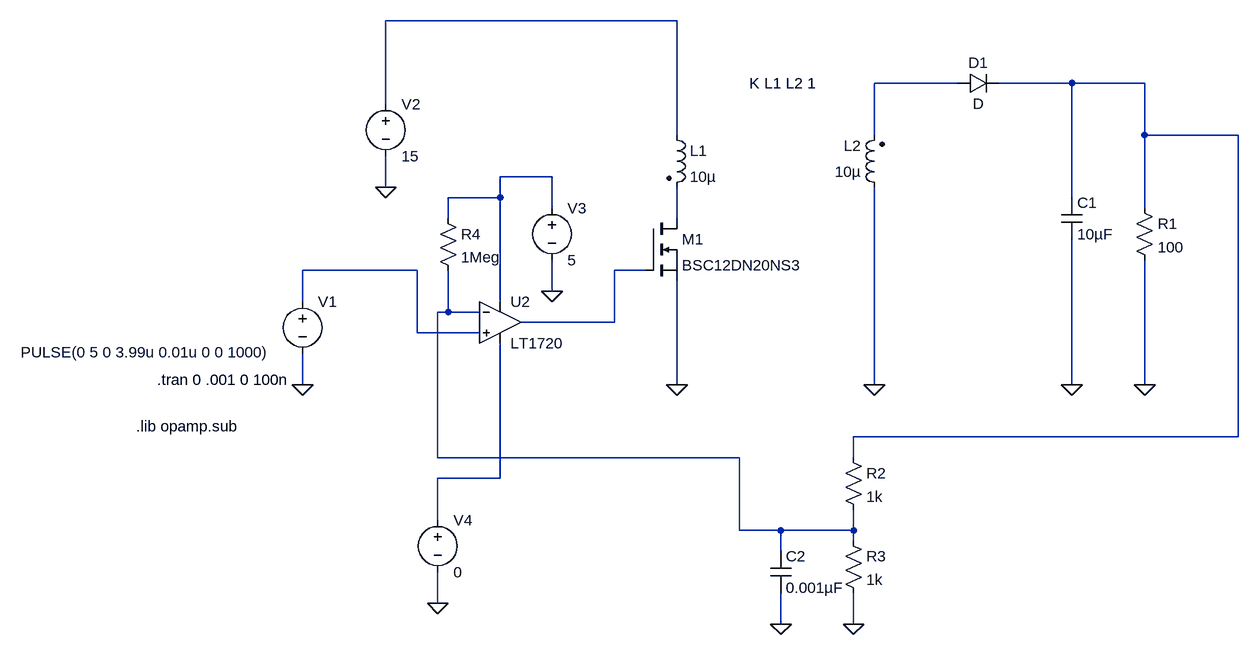
[diagram p0: schematic flyback.asc]
flyback.asc, the LTspice schematic file:
Version 4
SHEET 1 1252 836
WIRE 288 -288 -160 -288
WIRE 720 -192 592 -192
WIRE 896 -192 784 -192
WIRE 1008 -192 896 -192
WIRE -160 -160 -160 -288
WIRE 288 -112 288 -288
WIRE 592 -112 592 -192
WIRE 1008 -112 1008 -192
WIRE 1152 -112 1008 -112
WIRE 96 -48 16 -48
WIRE -160 -32 -160 -80
WIRE 16 -16 16 -48
WIRE 16 -16 -64 -16
WIRE 896 -16 896 -192
WIRE 96 0 96 -48
WIRE 1008 0 1008 -112
WIRE -64 16 -64 -16
WIRE 288 16 288 -32
WIRE -112 96 -288 96
WIRE 240 96 192 96
WIRE 96 128 96 80
WIRE -288 144 -288 96
WIRE 16 144 16 -16
WIRE -64 160 -64 96
WIRE -64 160 -80 160
WIRE -16 160 -64 160
WIRE 192 176 192 96
WIRE 192 176 48 176
WIRE -112 192 -112 96
WIRE -16 192 -112 192
WIRE -288 272 -288 224
WIRE 288 272 288 112
WIRE 592 272 592 -32
WIRE 896 272 896 48
WIRE 1008 272 1008 80
WIRE 1152 352 1152 -112
WIRE 1152 352 560 352
WIRE -80 384 -80 160
WIRE 384 384 -80 384
WIRE 560 384 560 352
WIRE 16 416 16 208
WIRE 16 416 -80 416
WIRE -80 480 -80 416
WIRE 384 496 384 384
WIRE 448 496 384 496
WIRE 560 496 560 464
WIRE 560 496 448 496
WIRE 560 512 560 496
WIRE 448 528 448 496
WIRE -80 608 -80 560
WIRE 448 640 448 592
WIRE 560 640 560 592
FLAG -288 272 0
FLAG 288 272 0
FLAG -160 -32 0
FLAG 592 272 0
FLAG 896 272 0
FLAG 1008 272 0
FLAG 96 128 0
FLAG 560 640 0
FLAG -80 608 0
FLAG 448 640 0
SYMBOL voltage -288 128 R0
WINDOW 3 -49 94 Right 2
WINDOW 123 0 0 Left 2
WINDOW 39 0 0 Left 2
SYMATTR Value PULSE(0 5 0 3.99u 0.01u 0 0 1000)
SYMATTR InstName V1
SYMBOL ind2 272 -128 R0
SYMATTR InstName L1
SYMATTR Value 10µ
SYMATTR Type ind
SYMBOL nmos 240 16 R0
SYMATTR InstName M1
SYMATTR Value BSC12DN20NS3
SYMBOL voltage -160 -176 R0
WINDOW 123 0 0 Left 2
WINDOW 39 0 0 Left 2
SYMATTR InstName V2
SYMATTR Value 15
SYMBOL res 992 -16 R0
SYMATTR InstName R1
SYMATTR Value 100
SYMBOL ind2 608 -16 R180
WINDOW 0 36 80 Left 2
WINDOW 3 36 40 Left 2
SYMATTR InstName L2
SYMATTR Value 10µ
SYMATTR Type ind
SYMBOL cap 880 -16 R0
SYMATTR InstName C1
SYMATTR Value 10µF
SYMBOL diode 720 -176 R270
WINDOW 0 32 32 VTop 2
WINDOW 3 0 32 VBottom 2
SYMATTR InstName D1
SYMBOL voltage 96 -16 R0
WINDOW 123 0 0 Left 2
WINDOW 39 0 0 Left 2
SYMATTR InstName V3
SYMATTR Value 5
SYMBOL res 544 368 R0
SYMATTR InstName R2
SYMATTR Value 1k
SYMBOL res 544 496 R0
SYMATTR InstName R3
SYMATTR Value 1k
SYMBOL voltage -80 464 R0
WINDOW 123 0 0 Left 2
WINDOW 39 0 0 Left 2
SYMATTR InstName V4
SYMATTR Value 0
SYMBOL cap 432 528 R0
SYMATTR InstName C2
SYMATTR Value 0.001µF
SYMBOL res -80 0 R0
SYMATTR InstName R4
SYMATTR Value 1Meg
SYMBOL Comparators\\LT1720 16 112 R0
SYMATTR InstName U2
TEXT -512 264 Left 2 !.tran 0 .001 0 100n
TEXT 400 -192 Left 2 !K L1 L2 1
TEXT -544 336 Left 2 !.lib opamp.sub

The netlist it stands for:
* flyback.asc
V1 N006 0 PULSE(0 5 0 3.99u 0.01u 0 0 1000)
L1 N001 N005 10µ
M1 N005 N007 0 0 BSC12DN20NS3
V2 N001 0 15
R1 N003 0 100
L2 0 N002 10µ
C1 N003 0 10µF
D1 N002 N003 D
V3 N004 0 5
R2 N003 N008 1k
R3 N008 0 1k
V4 N009 0 0
C2 N008 0 0.001µF
R4 N004 N008 1Meg
XU2 N006 N008 N004 N009 N007 LT1720  ; pins In+ In- V+ V- OUT
.model D D
.lib standard.dio
.model NMOS NMOS
.model PMOS PMOS
.lib standard.mos
.tran 0 .001 0 100n
K L1 L2 1
.lib opamp.sub
.lib LT1720.sub
.backanno
.end